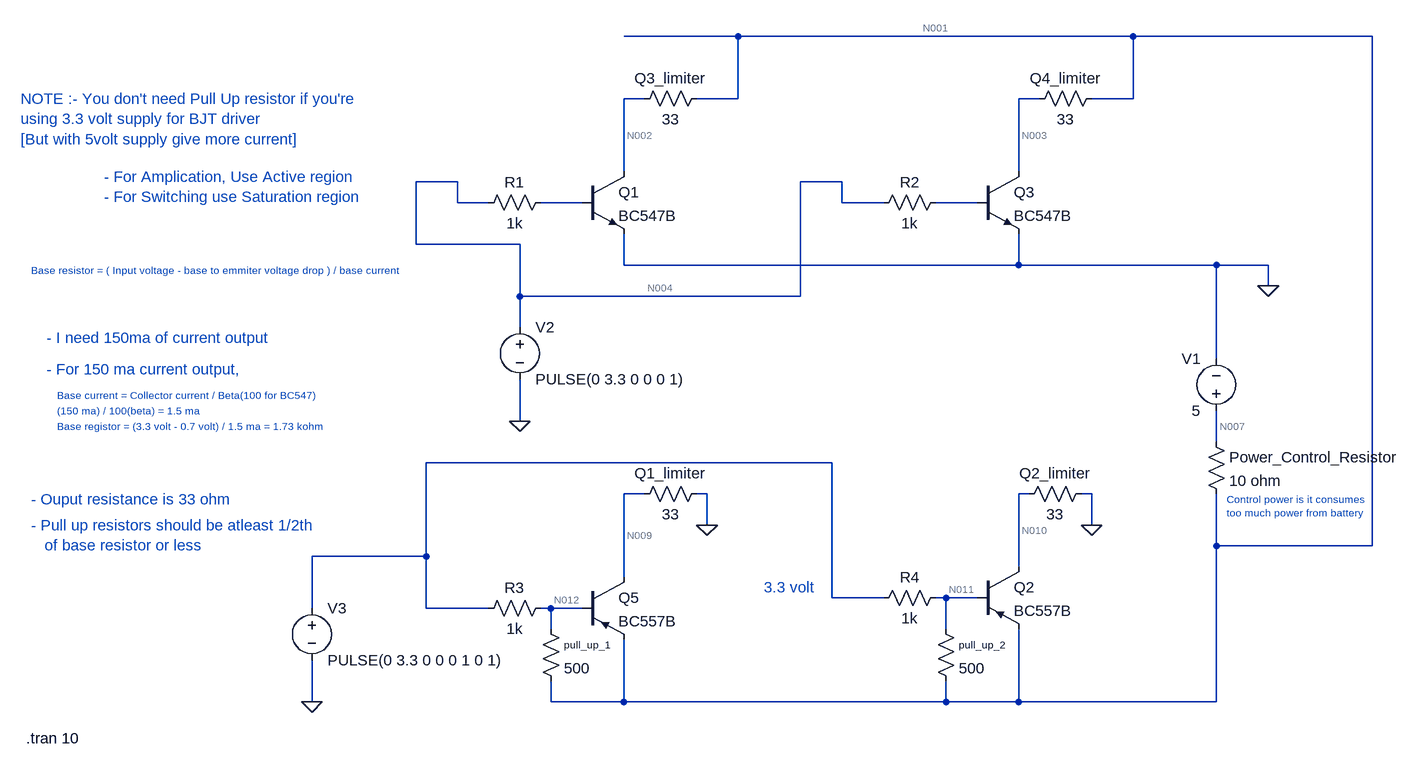
[diagram p0: schematic Driving BJT using BJT( for BJT motor Driver).asc]
Driving BJT using BJT( for BJT motor Driver).asc, the LTspice schematic file:
Version 4
SHEET 1 1848 968
WIRE 400 -128 224 -128
WIRE 1008 -128 400 -128
WIRE 1376 -128 1008 -128
WIRE 256 -32 224 -32
WIRE 400 -32 400 -128
WIRE 400 -32 336 -32
WIRE 864 -32 832 -32
WIRE 1008 -32 1008 -128
WIRE 1008 -32 944 -32
WIRE 224 80 224 -32
WIRE 832 80 832 -32
WIRE -32 96 -96 96
WIRE 560 96 496 96
WIRE -32 128 -32 96
WIRE 16 128 -32 128
WIRE 160 128 96 128
WIRE 560 128 560 96
WIRE 624 128 560 128
WIRE 768 128 704 128
WIRE -96 192 -96 96
WIRE 64 192 -96 192
WIRE 224 224 224 176
WIRE 832 224 832 176
WIRE 832 224 224 224
WIRE 1136 224 832 224
WIRE 1216 224 1136 224
WIRE 1216 256 1216 224
WIRE 64 272 64 192
WIRE 496 272 496 96
WIRE 496 272 64 272
WIRE 64 320 64 272
WIRE 1136 368 1136 224
WIRE 64 464 64 400
WIRE 1136 496 1136 448
WIRE 544 528 -80 528
WIRE 256 576 224 576
WIRE 352 576 336 576
WIRE 848 576 832 576
WIRE 944 576 928 576
WIRE 352 624 352 576
WIRE 944 624 944 576
WIRE 1136 656 1136 576
WIRE 1376 656 1376 -128
WIRE 1376 656 1136 656
WIRE -80 672 -80 528
WIRE -80 672 -256 672
WIRE 832 688 832 576
WIRE 224 704 224 576
WIRE 544 736 544 528
WIRE 624 736 544 736
WIRE 720 736 704 736
WIRE 768 736 720 736
WIRE -256 752 -256 672
WIRE -80 752 -80 672
WIRE 16 752 -80 752
WIRE 112 752 96 752
WIRE 160 752 112 752
WIRE 112 784 112 752
WIRE 720 784 720 736
WIRE -256 896 -256 832
WIRE 112 896 112 864
WIRE 224 896 224 800
WIRE 224 896 112 896
WIRE 720 896 720 864
WIRE 720 896 224 896
WIRE 832 896 832 784
WIRE 832 896 720 896
WIRE 1136 896 1136 656
WIRE 1136 896 832 896
FLAG 1216 256 0
FLAG 352 624 0
FLAG 944 624 0
FLAG 64 464 0
FLAG -256 896 0
SYMBOL npn 160 80 R0
SYMATTR InstName Q1
SYMATTR Value BC547B
SYMBOL npn 768 80 R0
SYMATTR InstName Q3
SYMATTR Value BC547B
SYMBOL pnp 160 704 R0
SYMATTR InstName Q5
SYMATTR Value BC557B
SYMBOL pnp 768 688 R0
SYMATTR InstName Q2
SYMATTR Value BC557B
SYMBOL res 112 736 R90
WINDOW 0 0 56 VBottom 2
WINDOW 3 32 56 VTop 2
SYMATTR InstName R3
SYMATTR Value 1k
SYMBOL res 720 720 R90
WINDOW 0 0 56 VBottom 2
WINDOW 3 32 56 VTop 2
SYMATTR InstName R4
SYMATTR Value 1k
SYMBOL res 720 112 R90
WINDOW 0 0 56 VBottom 2
WINDOW 3 32 56 VTop 2
SYMATTR InstName R2
SYMATTR Value 1k
SYMBOL res 112 112 R90
WINDOW 0 0 56 VBottom 2
WINDOW 3 32 56 VTop 2
SYMATTR InstName R1
SYMATTR Value 1k
SYMBOL voltage 1136 464 R180
WINDOW 0 24 96 Left 2
WINDOW 3 24 16 Left 2
SYMATTR InstName V1
SYMATTR Value 5
SYMBOL res 704 768 R0
WINDOW 0 36 40 Left 1
SYMATTR InstName pull_up_2
SYMATTR Value 500
SYMBOL res 96 768 R0
WINDOW 0 36 40 Left 1
SYMATTR InstName pull_up_1
SYMATTR Value 500
SYMBOL res 352 -48 R90
WINDOW 0 0 56 VBottom 2
WINDOW 3 32 56 VTop 2
SYMATTR InstName Q3_limiter
SYMATTR Value 33
SYMBOL res 960 -48 R90
WINDOW 0 0 56 VBottom 2
WINDOW 3 32 56 VTop 2
SYMATTR InstName Q4_limiter
SYMATTR Value 33
SYMBOL res 352 560 R90
WINDOW 0 0 56 VBottom 2
WINDOW 3 32 56 VTop 2
SYMATTR InstName Q1_limiter
SYMATTR Value 33
SYMBOL res 944 560 R90
WINDOW 0 0 56 VBottom 2
WINDOW 3 32 56 VTop 2
SYMATTR InstName Q2_limiter
SYMATTR Value 33
SYMBOL voltage 64 304 R0
WINDOW 123 0 0 Left 0
WINDOW 39 0 0 Left 0
SYMATTR InstName V2
SYMATTR Value PULSE(0 3.3 0 0 0 1)
SYMBOL voltage -256 736 R0
WINDOW 123 0 0 Left 0
WINDOW 39 0 0 Left 0
SYMATTR InstName V3
SYMATTR Value PULSE(0 3.3 0 0 0 1 0 1)
SYMBOL res 1120 480 R0
SYMATTR InstName Power_Control_Resistor
SYMATTR Value 10 ohm
TEXT -576 88 Left 2 ;- For Amplication, Use Active region \n- For Switching use Saturation region
TEXT -688 232 Left 1 ;Base resistor = ( Input voltage - base to emmiter voltage drop ) / base current
TEXT 440 720 Left 2 ;3.3 volt
TEXT -664 336 Left 2 ;- I need 150ma of current output
TEXT -664 384 Left 2 ;- For 150 ma current output,
TEXT -648 472 Left 1 ;Base registor = (3.3 volt - 0.7 volt) / 1.5 ma = 1.73 kohm
TEXT -648 424 Left 1 ;Base current = Collector current / Beta(100 for BC547)
TEXT -648 448 Left 1 ;(150 ma) / 100(beta) = 1.5 ma
TEXT -688 584 Left 2 ;- Ouput resistance is 33 ohm
TEXT -688 624 Left 2 ;- Pull up resistors should be atleast 1/2th \n   of base resistor or less
TEXT -696 952 Left 2 !.tran 10
TEXT -704 -32 Left 2 ;NOTE :- You don't need Pull Up resistor if you're \nusing 3.3 volt supply for BJT driver\n[But with 5volt supply give more current]
TEXT 1152 584 Left 1 ;Control power is it consumes \ntoo much power from battery

The netlist it stands for:
* Driving BJT using BJT( for BJT motor Driver).asc
Q1 N002 N005 0 0 BC547B
Q3 N003 N006 0 0 BC547B
Q5 N009 N012 N001 0 BC557B
Q2 N010 N011 N001 0 BC557B
R3 N012 N008 1k
R4 N011 N008 1k
R2 N006 N004 1k
R1 N005 N004 1k
V1 N007 0 5
R§pull_up_2 N011 N001 500
R§pull_up_1 N012 N001 500
R§Q3_limiter N001 N002 33
R§Q4_limiter N001 N003 33
R§Q1_limiter 0 N009 33
R§Q2_limiter 0 N010 33
V2 N004 0 PULSE(0 3.3 0 0 0 1)
V3 N008 0 PULSE(0 3.3 0 0 0 1 0 1)
R§Power_Control_Resistor N007 N001 10 ohm
.model NPN NPN
.model PNP PNP
.lib standard.bjt
* - For Amplication, Use Active region
* - For Switching use Saturation region
* Base resistor = ( Input voltage - base to emmiter voltage drop ) / base current
* 3.3 volt
* - I need 150ma of current output
* - For 150 ma current output,
* Base registor = (3.3 volt - 0.7 volt) / 1.5 ma = 1.73 kohm
* Base current = Collector current / Beta(100 for BC547)
* (150 ma) / 100(beta) = 1.5 ma
* - Ouput resistance is 33 ohm
* - Pull up resistors should be atleast 1/2th
*    of base resistor or less
.tran 10
* NOTE :- You don't need Pull Up resistor if you're
* using 3.3 volt supply for BJT driver
* [But with 5volt supply give more current]
* Control power is it consumes
* too much power from battery
.backanno
.end

* Results of the author's LTspice run, read from the files saved beside the schematic
* Operating Point, zero values left out:
*   V(n002) = 3.177 V
*   V(n003) = 3.177 V
*   V(n009) = 2.931 V
*   V(n012) = 2.356 V
*   V(n001) = 3.177 V
*   V(n010) = 2.931 V
*   V(n011) = 2.356 V
*   V(n007) = 5 V
*   Ic(Q1) = 3.267 pA
*   Ib(Q1) = -3.243 pA
*   Ic(Q3) = 3.268 pA
*   Ib(Q3) = -3.243 pA
*   Ic(Q5) = -88.8 mA
*   Ib(Q5) = -715.2 µA
*   Ie(Q5) = 89.52 mA
*   Ic(Q2) = -88.8 mA
*   Ib(Q2) = -715.2 µA
*   Ie(Q2) = 89.52 mA
*   I(R3) = 2.356 mA
*   I(R4) = 2.356 mA
*   I(R2) = 3.243 pA
*   I(R1) = 3.243 pA
*   I(Pull_up_2) = -1.641 mA
*   I(Pull_up_1) = -1.641 mA
*   I(Q3_limiter) = 3.268 pA
*   I(Q4_limiter) = 3.267 pA
*   I(Q1_limiter) = -88.8 mA
*   I(Q2_limiter) = -88.8 mA
*   I(Power_control_resistor) = 182.3 mA
*   I(V1) = -182.3 mA
*   I(V2) = 6.485 pA
*   I(V3) = 4.713 mA
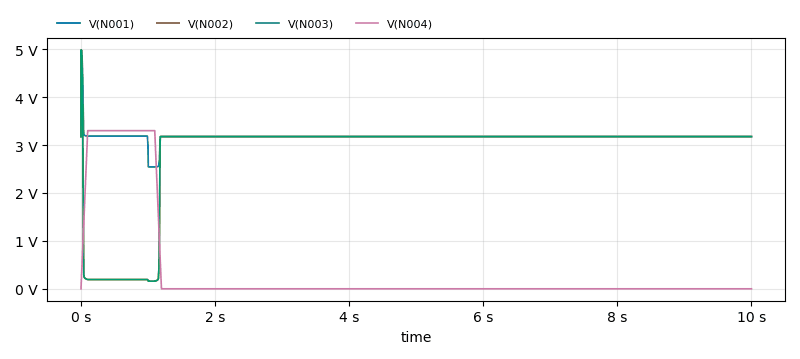
[diagram p1: Transient Analysis of Driving BJT using BJT( for BJT motor Driver).asc, plotted from the saved traces]
* Transient Analysis, 1 run:
*   V(N001): min 2.545 V, max 4.976 V, average 3.172 V, rms 3.174 V, last 3.177 V
*   V(N002): min 160 mV, max 4.976 V, average 2.841 V, rms 2.995 V, last 3.177 V
*   V(N003): min 160 mV, max 4.976 V, average 2.841 V, rms 2.995 V, last 3.177 V
*   V(N004): min 0 V, max 3.3 V, average 363 mV, rms 1.078 V, last 0 V